# Altium schematic sheet 5V_Supply.SchDoc
size 297 x 209 mm; SheetNumber: 9; SheetTotal: 11
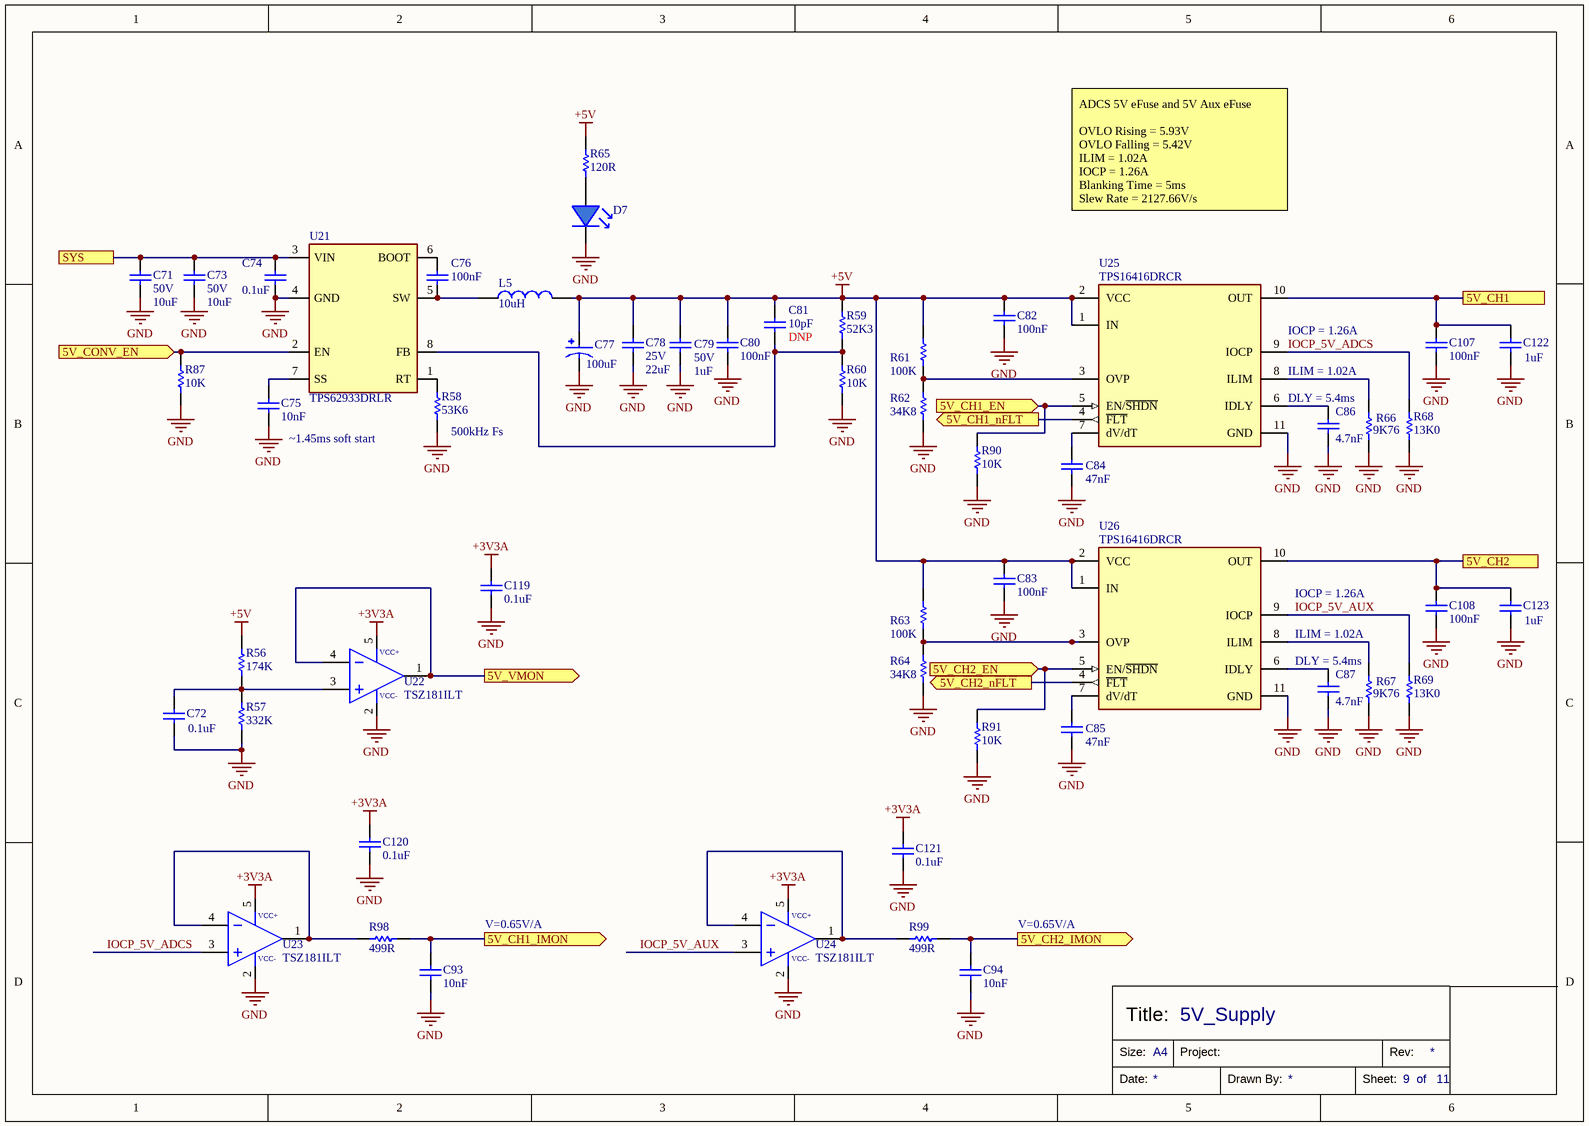
[diagram p0: 5V_Supply.SchDoc]

## Parts
C71  Voltage Rating: 50V  Capacitance: 10uF  [CAPC1210X090]  (hidden comment: CL32B106KBJNNNE)
C72  Capacitance: 0.1uF  [CAPC0805X060]  (hidden comment: CL21B104KACNNNC)
C73  Voltage Rating: 50V  Capacitance: 10uF  [CAPC1210X090]  (hidden comment: CL32B106KBJNNNE)
C74  Capacitance: 0.1uF  [CAPC0402X020]  (hidden comment: CL05B104KB5NNNC)
C75  Capacitance: 10nF  [CAPC0805X060]  (hidden comment: CL21B103KBANNNC)
C76  Capacitance: 100nF  [CAPC0603X040]  (hidden comment: C0603C104K5RACTU)
C77  Capacitance: 100uF  [2312 Tantalum]  (hidden comment: TPSC107K010R0100)
C78  Voltage Rating: 25V  Capacitance: 22uF  [CAPC1210X090]  (hidden comment: CL32B226KAJNNNE)
C79  Voltage Rating: 50V  Capacitance: 1uF  [CAPC0805X060]  (hidden comment: CL21B105KBFNNNE)
C80  Capacitance: 100nF  [CAPC0603X040]  (hidden comment: C0603C104K5RACTU)
C81  Capacitance: 10pF  [CAPC0603X040]  (hidden comment: C0603C104K5RACTU)
C82  Capacitance: 100nF  [CAPC0603X040]  (hidden comment: C0603C104K5RACTU)
C83  Capacitance: 100nF  [CAPC0603X040]  (hidden comment: C0603C104K5RACTU)
C84  Capacitance: 47nF  [CAPC0805X060]  (hidden comment: CL21B473KBCNNNC)
C85  Capacitance: 47nF  [CAPC0805X060]  (hidden comment: CL21B473KBCNNNC)
C86  Capacitance: 4.7nF  [CAPC0805X060]  (hidden comment: CL21B105KAFNNNE)
C87  Capacitance: 4.7nF  [CAPC0805X060]  (hidden comment: CL21B105KAFNNNE)
C93  Capacitance: 10nF  [CAPC0805X060]  (hidden comment: CL21B103KBANNNC)
C94  Capacitance: 10nF  [CAPC0805X060]  (hidden comment: CL21B103KBANNNC)
C107  Capacitance: 100nF  [CAPC0603X040]  (hidden comment: C0603C104K5RACTU)
C108  Capacitance: 100nF  [CAPC0603X040]  (hidden comment: C0603C104K5RACTU)
C119  Capacitance: 0.1uF  [CAPC0603X040]  (hidden comment: C0603C104K5RACTU)
C120  Capacitance: 0.1uF  [CAPC0603X040]  (hidden comment: C0603C104K5RACTU)
C121  Capacitance: 0.1uF  [CAPC0603X040]  (hidden comment: C0603C104K5RACTU)
C122  Capacitance: 1uF  [CAPC0805X060]  (hidden comment: CL21B105KAFNNNE)
C123  Capacitance: 1uF  [CAPC0805X060]  (hidden comment: CL21B105KAFNNNE)
D7  LSM0805463V  [LEDB_0805]  (value not drawn)
L5  Inductance: 10uH  [1274AS-H-100M=P3]  (hidden comment: 1274AS-H-100M=P3)
R56  Resistance: 174K  [RESC0603]  (hidden comment: RMCF0603FT174K)
R57  Resistance: 332K  [RESC0805]  (hidden comment: RMCF0805FT332K)
R58  Resistance: 53K6  [RESC0805]  (hidden comment: RMCF0805FT53K6)
R59  Resistance: 52K3  [RESC0603]  (hidden comment: RMCF0603FT52K3)
R60  Resistance: 10K  [RESC0603]  (hidden comment: RMCF0603FT10K0)
R61  Resistance: 100K  [RESC0805]  (hidden comment: RMCF0805FG100K)
R62  Resistance: 34K8  [RESC0805]  (hidden comment: RMCF0805FT34K8)
R63  Resistance: 100K  [RESC0805]  (hidden comment: RMCF0805FG100K)
R64  Resistance: 34K8  [RESC0805]  (hidden comment: RMCF0805FT34K8)
R65  Resistance: 120R  [RESC0805]  (hidden comment: RMCF0805FT120R)
R66  Resistance: 9K76  [RESC0805]  (hidden comment: RMCF0805FT9K76)
R67  Resistance: 9K76  [RESC0805]  (hidden comment: RMCF0805FT9K76)
R68  Resistance: 13K0  [RESC0805]  (hidden comment: RMCF0805FT13K0)
R69  Resistance: 13K0  [RESC0805]  (hidden comment: RMCF0805FT13K0)
R87  Resistance: 10K  [RESC0805]  (hidden comment: RMCF0805FT10K0)
R90  Resistance: 10K  [RESC0805]  (hidden comment: RMCF0805FT10K0)
R91  Resistance: 10K  [RESC0805]  (hidden comment: RMCF0805FT10K0)
R98  Resistance: 499R  [RESC0805]  (hidden comment: RMCF0805FT499R)
R99  Resistance: 499R  [RESC0805]  (hidden comment: RMCF0805FT499R)
U21  TPS62933DRLR  [SOT-583]
U22  TSZ181ILT  [SOT23-5 IC]
U23  TSZ181ILT  [SOT23-5 IC]
U24  TSZ181ILT  [SOT23-5 IC]
U25  Part Number: TPS16416DRCR  [TPS1641]  (hidden comment: TPS16410DRCR)
U26  Part Number: TPS16416DRCR  [TPS1641]  (hidden comment: TPS16410DRCR)

## Ports
5V_CH1 (see PDM[6B], PC104[4B], PC104[5B]), 5V_CH1_EN (in, see PDM[5B], Controller[3C]), 5V_CH1_IMON (out, see PDM[5B], Controller[1B]), 5V_CH1_nFLT (out, see PDM[5B], Controller[3C]), 5V_CH2 (see PDM[6B], PC104[2B], PC104[3B], PC104[4B], PC104[5B]), 5V_CH2_EN (in, see PDM[5B], Controller[1C]), 5V_CH2_IMON (out, see PDM[5B], Controller[1B]), 5V_CH2_nFLT (out, see PDM[5B], Controller[1C]), 5V_CONV_EN (in, see PDM[5B], Controller[3D]), 5V_VMON (out, see PDM[5B], Controller[3B]), SYS (see PDM[5B], 3V3_Supply[1B], 6V_Supply[1B], 12V_Supply[1A], PC104[4C], PC104[5C])

## Nets
+3V3A: C119.2 C120.2 C121.2 U22.5(VCC+) U23.5(VCC+) U24.5(VCC+)
+5V: C77.1 C78.2 C79.2 C80.2 C81.2 C82.2 C83.2 L5.2 R56.2 R59.2 R61.2 R63.2 R65.2 U25.1(IN) U25.2(VCC) U26.1(IN) U26.2(VCC)
GND: C71.1 C72.1 C73.1 C74.1 C75.1 C77.2 C78.1 C79.1 C80.1 C82.1 C83.1 C84.1 C85.1 C86.1 C87.1 C93.1 C94.1 C107.1 C108.1 C119.1 C120.1 C121.1 C122.1 C123.1 D7.K R57.1 R58.1 R60.1 R62.1 R64.1 R66.1 R67.1 R68.1 R69.1 R87.1 R90.1 R91.1 U21.4(GND) U22.2(VCC-) U23.2(VCC-) U24.2(VCC-) U25.11(GND) U26.11(GND)
5V_CH1: C107.2 C122.2 U25.10(OUT) ; port 5V_CH1
5V_CH1_EN: R90.2 U25.5(EN/~{SHDN}) ; port 5V_CH1_EN
5V_CH1_IMON: C93.2 R98.2 ; port 5V_CH1_IMON
5V_CH1_nFLT: U25.4(~{FLT}) ; port 5V_CH1_nFLT
5V_CH2: C108.2 C123.2 U26.10(OUT) ; port 5V_CH2
5V_CH2_EN: R91.2 U26.5(EN/~{SHDN}) ; port 5V_CH2_EN
5V_CH2_IMON: C94.2 R99.2 ; port 5V_CH2_IMON
5V_CH2_nFLT: U26.4(~{FLT}) ; port 5V_CH2_nFLT
5V_CONV_EN: R87.2 U21.2(EN) ; port 5V_CONV_EN
5V_VMON: U22.1(OUT) U22.4(IN-) ; port 5V_VMON
IOCP_5V_ADCS: R68.2 U23.3(IN+) U25.9(IOCP)
IOCP_5V_AUX: R69.2 U24.3(IN+) U26.9(IOCP)
SYS: C71.2 C73.2 C74.2 U21.3(VIN) ; port SYS
NetC72_2: C72.2 R56.1 R57.2 U22.3(IN+)
NetC75_2: C75.2 U21.7(SS)
NetC76_1: C76.1 L5.1 U21.5(SW)
NetC76_2: C76.2 U21.6(BOOT)
NetC81_1: C81.1 R59.1 R60.2 U21.8(FB)
NetC84_2: C84.2 U25.7(dV/dT)
NetC85_2: C85.2 U26.7(dV/dT)
NetC86_2: C86.2 U25.6(IDLY)
NetC87_2: C87.2 U26.6(IDLY)
NetD7_A: D7.A R65.1
NetR58_2: R58.2 U21.1(RT)
NetR61_1: R61.1 R62.2 U25.3(OVP)
NetR63_1: R63.1 R64.2 U26.3(OVP)
NetR66_2: R66.2 U25.8(ILIM)
NetR67_2: R67.2 U26.8(ILIM)
NetR98_1: R98.1 U23.1(OUT) U23.4(IN-)
NetR99_1: R99.1 U24.1(OUT) U24.4(IN-)

## Notes on the sheet
- ADCS 5V eFuse and 5V Aux eFuse
  OVLO Rising = 5.93V
  OVLO Falling = 5.42V
  ILIM = 1.02A
  IOCP = 1.26A
  Blanking Time = 5ms
  Slew Rate = 2127.66V/s
- (near C81) DNP
- (near U25) IOCP = 1.26A
- DLY = 5.4ms
- ILIM = 1.02A
- ~1.45ms soft start
- (near R58) 500kHz Fs
- (near U26) IOCP = 1.26A
- V=0.65V/A
- 5V_Supply
- Size:
- Title:
- A4
- Project:
- Rev:
- Date:
- Drawn By:
- Sheet:
- of

## Library data of the parts
C71 C73 = CL32B106KBJNNNE: 10 µF ±10% 50V Ceramic Capacitor X7R 1210 (3225 Metric); Manufacturer Part Number: CL32B106KBJNNNE; Distributor Part Number: 1276-3387-1-ND; Tolerance: 10%; Case Code: 1210; Distributor: Digikey
C72 = CL21B104KACNNNC: 0.1uF ±10% 25V Ceramic Capacitor X7R 0805 (2012 Metric); Part Number: CL21B104KACNNNC; Distributor Part Number: 1276-1099-1-ND; Tolerance: 10%; Case Code: 0805; Distributor: Digikey; Voltage Rating: 25V
C74 = CL05B104KB5NNNC: 0.1 µF ±10% 50V Ceramic Capacitor X7R 0402 (1005 Metric); Part Number: CL05B104KB5NNNC; Tolerance: 10%; Distributor Part Number: 1276-CL05B104KB5NNNCCT-ND; Case Code: 0402; Distributor: Digikey; Voltage Rating: 50V
C75 C93 C94 = CL21B103KBANNNC: 10nF ±10% 50V Ceramic Capacitor X7R 0805 (2012 Metric); Voltage Rating: 25V; Part Number: CL21B103KBANNNC; Distributor Part Number: 1276-1015-1-ND; Tolerance: 10%; Case Code: 0805; Distributor: Digikey
C76 C80 C82 C83 C107 C108 C119-C121 = C0603C104K5RACTU: 0.1 µF ±10% 50V Ceramic Capacitor X7R 0603 (1608 Metric); Distributor Part Number: 399-C0603C104K5RACTUCT-ND; Tolerance: 10%; Case Code: 0603; Distributor: Digikey; Voltage Rating: 50V
  C76: Manufacturer Part Number: C0603C104K5RACTU
  C80 C82 C83 C107 C108 C119-C121: Part Number: C0603C104K5RACTU
C77 = TPSC107K010R0100: 100 µF Molded Tantalum Capacitors 10 V 2312 (6032 Metric) 100mOhm; Voltage Rating: 10V; Part Number: TPSC107K010R0100; Distributor: Digikey; Distributor Part Number: 478-1765-1-ND; ESR: 100mOhm; Operating Temperature: -55°C ~ 125°C
C78 = CL32B226KAJNNNE: 22 µF ±10% 25V Ceramic Capacitor X7R 1210 (3225 Metric); Part Number: CL32B226KAJNNNE; Distributor Part Number: 1276-3392-1-ND; Tolerance: 10%; Case Code: 1210; Distributor: Digikey
C79 = CL21B105KBFNNNE: 1uF 50V X7R ±10% 0805 Multilayer Ceramic Capacitors MLCC - SMD/SMT ROHS; Part Number: CL21B105KBFNNNE; Distributor Part Number: 1276-1029-1-ND; Tolerance: 10%; Case Code: 0805; Distributor: Digikey
C81 = C0603C100J5GACTU: 10 pF ±5% 50V Ceramic Capacitor C0G, NP0 0603 (1608 Metric); Tolerance: 10%; Part Number: C0603C100J5GACTU; Distributor Part Number: 399-C0603C100J5GACTUCT-ND; Case Code: 0603; Distributor: Digikey; Voltage Rating: 50V
C84 C85 = CL21B473KBCNNNC: 0.047 µF ±10% 50V Ceramic Capacitor X7R 0805 (2012 Metric); Voltage Rating: 25V; Part Number: CL21B473KBCNNNC; Distributor Part Number: 1276-1250-1-ND; Tolerance: 10%; Case Code: 0805; Distributor: Digikey
C86 C87 = CL21B472KBANNNC: 4.7nF ±10% 50V Ceramic Capacitor X7R 0805 (2012 Metric); Voltage Rating: 25V; Part Number: CL21B472KBANNNC; Distributor Part Number: 1276-1155-1-ND; Tolerance: 10%; Case Code: 0805; Distributor: Digikey
C122 C123 = CL21B105KAFNNNE: 1uF ±10% 25V Ceramic Capacitor X7R 0805 (2012 Metric); Part Number: CL21B105KAFNNNE; Distributor Part Number: 1276-1066-1-ND; Tolerance: 10%; Case Code: 0805; Distributor: Digikey; Voltage Rating: 25V
D7 = LEDB0805: Blue 469nm LED Indication - Discrete 3V 0805 (2012 Metric); Manufacturer Part Number: LSM0805463V; Distributor Part Number: 28-LSM0805463VCT-ND; Colour: Blue; Operating Temperature: *; Voltage - Forward: 3V; Distributor: Digikey
L5 = 1274AS-H-100M=P3: Inductor 10 µH , 4.4 A 30.4mOhm Max Shielded Drum Core; Current Rating: 4.4A; Saturation Current: 6.2A; Part Number: 1274AS-H-100M=P3; Distributor Part Number: 490-10846-1-ND; Distributor: Digikey; DCR: 30.4mOhm
R56 = RMCF0603FT174K: 174 kOhms ±1% 0.1W, 1/10W Chip Resistor 0603 (1608 Metric) Automotive AEC-Q200 Thick Film; Manufacturer Part Number: RMCF0603FT174K; Tolerance: 1%; Distributor: Digikey; Distributor Part Number: RMCF0603FT174KCT-ND; Case Code: 0603
R57 = RMCF0805FT332K: 332 kOhms ±1% 0.125W, 1/8W Chip Resistor 0805 (2012 Metric) Automotive AEC-Q200 Thick Film; Part Number: RMCF0805FT332K; Tolerance: 1%; Distributor Part Number: RMCF0805FT332KCT-ND; Distributor: Digikey; Case Code: 0805
R58 = RMCF0805FT53K6: 53.6 kOhms ±1% 0.125W, 1/8W Chip Resistor 0805 (2012 Metric) Automotive AEC-Q200 Thick Film; Part Number: RMCF0805FT53K6; Tolerance: 1%; Distributor Part Number: RMCF0805FT53K6CT-ND; Distributor: Digikey; Case Code: 0805
R59 = RMCF0603FT52K3: 52.3 kOhms ±1% 0.1W, 1/10W Chip Resistor 0603 (1608 Metric) Automotive AEC-Q200 Thick Film; Part Number: RMCF0603FT52K3; Tolerance: 1%; Distributor: Digikey; Distributor Part Number: RMCF0603FT174KCT-ND; Case Code: 0603
R60 = RMCF0603FT10K0: 10 kOhms ±1% 0.1W, 1/10W Chip Resistor 0603 (1608 Metric) Automotive AEC-Q200 Thick Film; Tolerance: 1%; Distributor Part Number: RMCF0603FT10K0CT-ND; Distributor: Digikey; Case Code: 0603; Part Number: RMCF0603FT10K0
R61 R63 = RMCF0805FG100K: 100 kOhms ±1% 0.125W, 1/8W Chip Resistor 0805 (2012 Metric) Automotive AEC-Q200 Thick Film; Part Number: RMCF0805FG100K; Tolerance: 1%; Distributor Part Number: RMCF0805FG100KCT-ND; Distributor: Digikey; Case Code: 0805
R62 R64 = RMCF0805FT34K8: 34.8 kOhms ±1% 0.125W, 1/8W Chip Resistor 0805 (2012 Metric) Automotive AEC-Q200 Thick Film; Part Number: RMCF0805FT34K8; Tolerance: 1%; Distributor Part Number: RMCF0805FT34K8CT-ND; Distributor: Digikey; Case Code: 0805
R65 = RMCF0805FT120R: 120 Ohms ±1% 0.125W, 1/8W Chip Resistor 0805 (2012 Metric) Automotive AEC-Q200 Thick Film; Part Number: RMCF0805FT120R; Tolerance: 1%; Distributor Part Number: 738-RMCF0805FT120RCT-ND; Distributor: Digikey; Case Code: 0805
R66 R67 = RMCF0805FT9K76: 9.76 kOhms ±1% 0.125W, 1/8W Chip Resistor 0805 (2012 Metric) Automotive AEC-Q200 Thick Film; Part Number: RMCF0805FT9K76; Tolerance: 1%; Distributor Part Number: RMCF0805FT9K76CT-ND; Distributor: Digikey; Case Code: 0805
R68 R69 = RMCF0805FT13K0: 13 kOhms ±1% 0.125W, 1/8W Chip Resistor 0805 (2012 Metric) Automotive AEC-Q200 Thick Film; Part Number: RMCF0805FT13K0; Tolerance: 1%; Distributor Part Number: RMCF0805FT13K0CT-ND; Distributor: Digikey; Case Code: 0805
R87 R90 R91 = RMCF0805FT10K0: 10 kOhms ±1% 0.125W, 1/8W Chip Resistor 0805 (2012 Metric) Automotive AEC-Q200 Thick Film; Part Number: RMCF0805FT10K0; Tolerance: 1%; Distributor Part Number: RMCF0805FT10K0CT-ND; Distributor: Digikey; Case Code: 0805
R98 R99 = RMCF0805FT499R: 499 Ohms ±1% 0.125W, 1/8W Chip Resistor 0805 (2012 Metric) Automotive AEC-Q200 Thick Film; Part Number: RMCF0805FT499R; Tolerance: 1%; Distributor Part Number: RMCF0805FT499RCT-ND; Distributor: Digikey; Case Code: 0805
U21 = TPS62933DRLR: Buck Switching Regulator IC Positive Adjustable 0.8V 1 Output 3A SOT-583; Voltage - Input (Min): 3.8V; Voltage - Input (Max): 30V; Voltage - Output (Max): 22V; Part Number: TPS62933DRLR; Distributor Part Number: 296-TPS62933DRLRCT-ND; Distributor: Digikey; Operating Temperature: -40°C ~ 150°C (TJ); Current Output: 3A; Voltage - Output (Min): 0.8V
U22-U24 = TSZ181ILT: Operational Amplifier, General Purpose, 2.2V~5.5V; Voltage Supply (Min): 2.2V; Voltage Supply (Max): 5.5V; Slew Rate: 4.7V/us; Gain Bandwidth Product: 3MHz; Part Number: TSZ181ILT; Distributor: Digikey; Distributor Part Number: 497-18084-1-ND; Operating Temperature: -40°C ~ 125°C
U25 U26 = TPS16410DRCR: 2.7-V to 40-V 152-mΩ 1.8-A eFuse with output power limiting; Qualification: None; Current - Output: 1.8A; Voltage - Input: 2.7V ~ 40V; Distributor Part Number: 296-TPS16410DRCRCT-ND; Package: 10-VSON (3x3); Distributor: Digikey; Operating Temperature: -40C ~ 125C